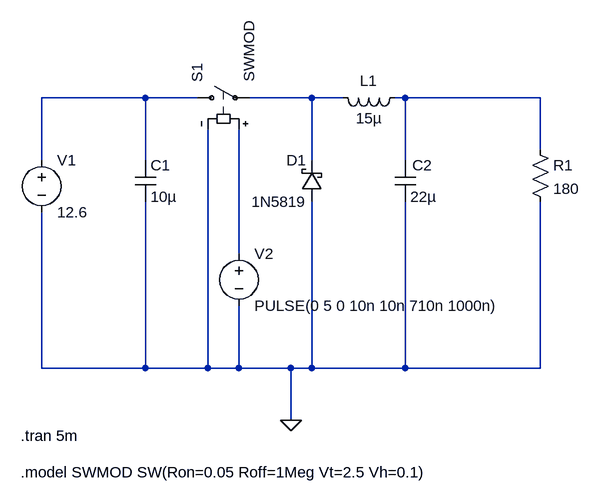
[diagram p0: schematic electronics_task1.asc]
electronics_task1.asc, the LTspice schematic file:
Version 4.1
SHEET 1 880 680
WIRE 64 -32 -96 -32
WIRE 144 -32 64 -32
WIRE 320 -32 224 -32
WIRE 368 -32 320 -32
WIRE 464 -32 448 -32
WIRE 672 -32 464 -32
WIRE 672 48 672 -32
WIRE -96 64 -96 -32
WIRE 64 64 64 -32
WIRE 320 64 320 -32
WIRE 464 64 464 -32
WIRE 208 208 208 16
WIRE -96 384 -96 144
WIRE 64 384 64 128
WIRE 64 384 -96 384
WIRE 160 384 160 16
WIRE 160 384 64 384
WIRE 208 384 208 288
WIRE 208 384 160 384
WIRE 288 384 208 384
WIRE 320 384 320 128
WIRE 320 384 288 384
WIRE 464 384 464 128
WIRE 464 384 320 384
WIRE 672 384 672 128
WIRE 672 384 464 384
WIRE 288 464 288 384
FLAG 288 464 0
SYMBOL voltage -96 48 R0
WINDOW 123 0 0 Left 0
WINDOW 39 0 0 Left 0
SYMATTR InstName V1
SYMATTR Value 12.6
SYMBOL schottky 336 128 R180
WINDOW 0 24 64 Left 2
WINDOW 3 24 0 Left 2
SYMATTR InstName D1
SYMATTR Value 1N5819
SYMATTR Description Diode
SYMATTR Type diode
SYMBOL ind 464 -48 R90
WINDOW 0 5 56 VBottom 2
WINDOW 3 32 56 VTop 2
SYMATTR InstName L1
SYMATTR Value 15µ
SYMATTR SpiceLine Rser=1m
SYMBOL cap 48 64 R0
SYMATTR InstName C1
SYMATTR Value 10µ
SYMBOL cap 448 64 R0
WINDOW 0 27 8 Left 2
SYMATTR InstName C2
SYMATTR Value 22µ
SYMBOL res 656 32 R0
SYMATTR InstName R1
SYMATTR Value 180
SYMBOL voltage 208 192 R0
WINDOW 123 0 0 Left 0
WINDOW 39 0 0 Left 0
SYMATTR InstName V2
SYMATTR Value PULSE(0 5 0 10n 10n 710n 1000n)
SYMBOL sw 128 -32 R270
SYMATTR InstName S1
SYMATTR Value SWMOD
TEXT -128 488 Left 2 !.tran 5m
TEXT -128 544 Left 2 !.model SWMOD SW(Ron=0.05 Roff=1Meg Vt=2.5 Vh=0.1)

The netlist it stands for:
* electronics_task1.asc
V1 N001 0 12.6
D1 0 N002 1N5819
L1 N003 N002 15µ Rser=1m
C1 N001 0 10µ
C2 N003 0 22µ
R1 N003 0 180
V2 N004 0 PULSE(0 5 0 10n 10n 710n 1000n)
S1 N001 N002 N004 0 SWMOD
.model D D
.lib standard.dio
.tran 5m
.model SWMOD SW(Ron=0.05 Roff=1Meg Vt=2.5 Vh=0.1)
.backanno
.end